# EAGLE design Battery levelling (EAGLE 9.6.1)
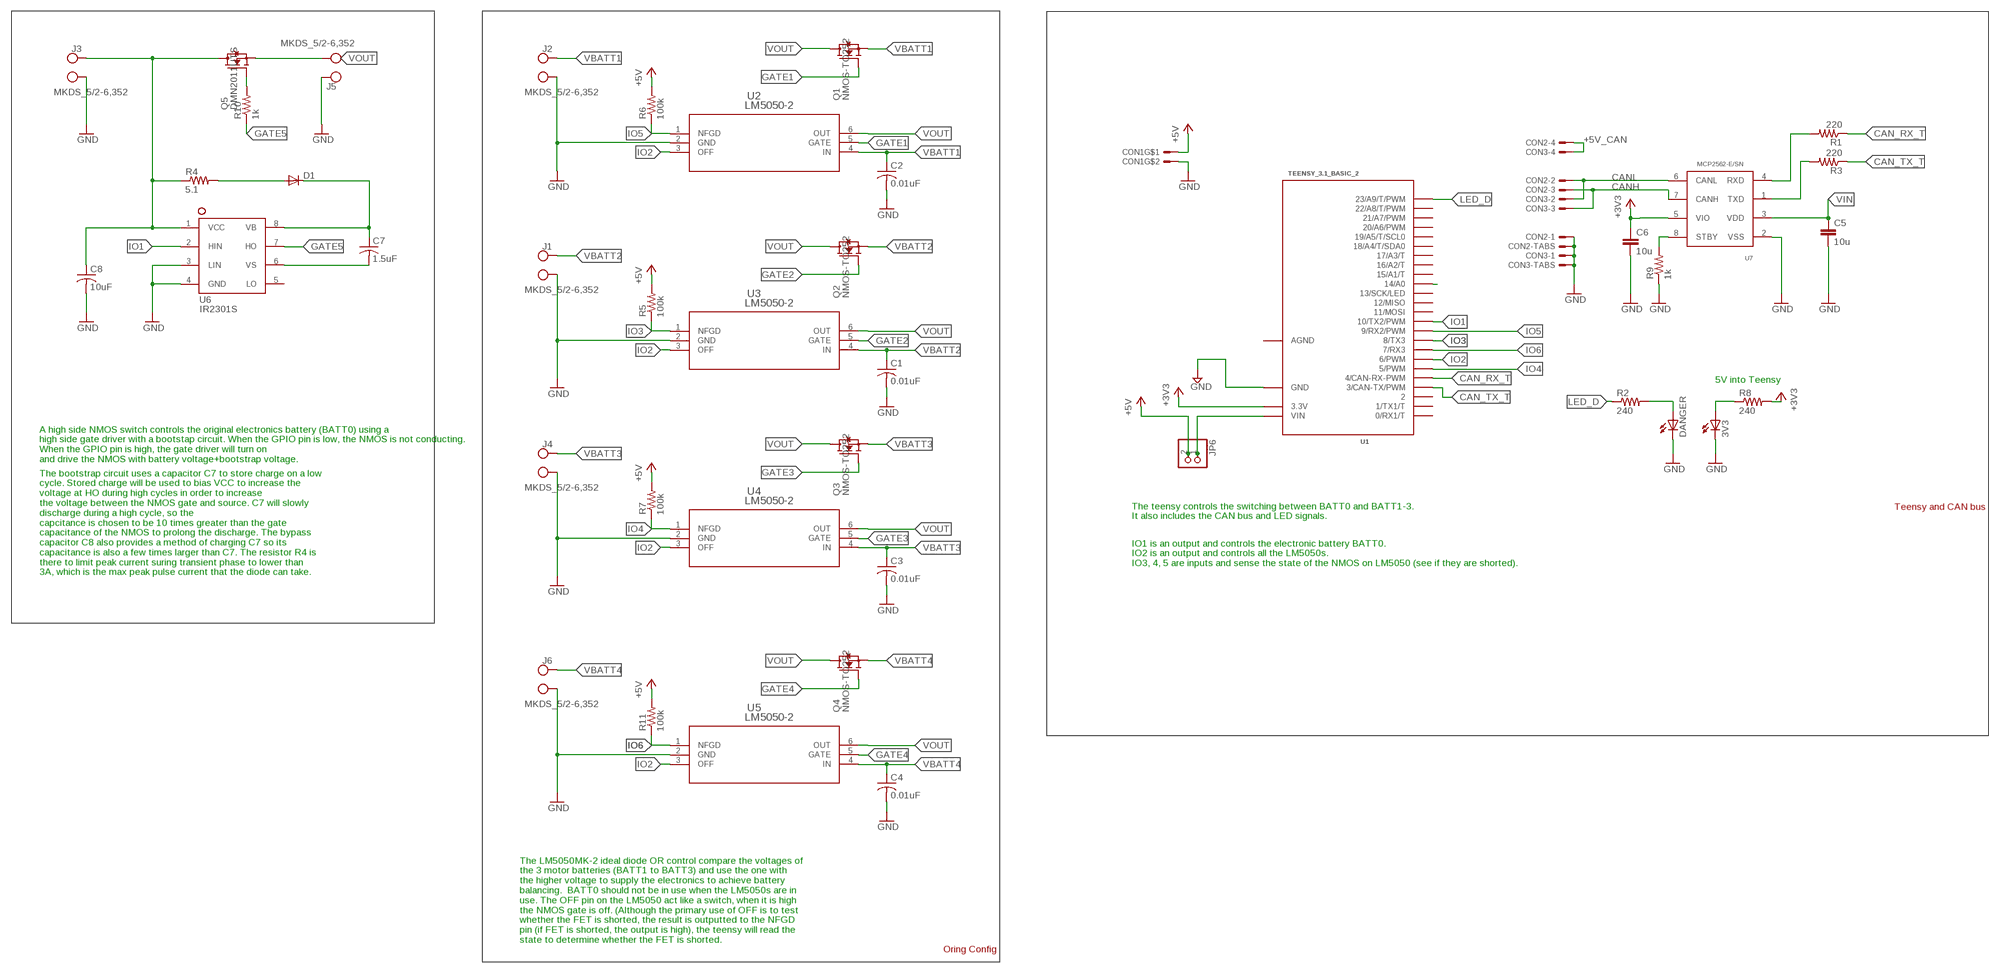
[diagram p0: schematic, sheet 1]

## Parts
3V3  LEDSMT1206  [1206]
C1  0.01uF  C-USC0805  [C0805]
C2  0.01uF  C-USC0805  [C0805]
C3  0.01uF  C-USC0805  [C0805]
C4  0.01uF  C-USC0805  [C0805]
C5  10u  C-EUC0805  [C0805]
C6  10u  C-EUC0805  [C0805]
C7  1.5uF  C-USC0805  [C0805]
C8  10uF  C-USC1206  [C1206]
CON1  MOLEX_5566-2  [5566-2]
CON2  SM04B-GHS-TB  [SM04B-GHS-TB]
CON3  SM04B-GHS-TB  [SM04B-GHS-TB]
D1  DIODE-DO-214AC  [DO-214AC]
DANGER  LEDSMT1206  [1206]
J1  MKDS_5/2-6,352  [MKDS_5/2-6,35]
J2  MKDS_5/2-6,352  [MKDS_5/2-6,35]
J3  MKDS_5/2-6,352  [MKDS_5/2-6,35]
J4  MKDS_5/2-6,352  [MKDS_5/2-6,35]
J5  MKDS_5/2-6,352  [MKDS_5/2-6,35]
J6  MKDS_5/2-6,352  [MKDS_5/2-6,35]
JP6  PINHD-1X2  [1X02]
Q1  NMOS-TO252  [TO252]
Q2  NMOS-TO252  [TO252]
Q3  NMOS-TO252  [TO252]
Q4  NMOS-TO252  [TO252]
Q5  DMN2011UTS  [SOP65P640X120-8N]
R1  220  R-US_R0805  [R0805]
R2  240  R-US_R1206  [R1206]
R3  220  R-US_R0805  [R0805]
R4  5.1  R-US_R1206  [R1206]
R5  100k  R-US_R1206  [R1206]
R6  100k  R-US_R1206  [R1206]
R7  100k  R-US_R1206  [R1206]
R8  240  R-US_R1206  [R1206]
R9  1k  R-US_R0805  [R0805]
R10  1k  R-US_R0805  [R0805]
R11  100k  R-US_R1206  [R1206]
U1  TEENSY_3.1_BASIC_2  [TEENSY_3.1_BASIC_2]
U2  LM5050-2  [MK06A]
U3  LM5050-2  [MK06A]
U4  LM5050-2  [MK06A]
U5  LM5050-2  [MK06A]
U6  IR2301S  [SOIC8]
U7  MCP2562-E/SN  [SOIC8]

## Nets
+3V3: C6.1 R8.2 U1.3.3V U7.5(VIO)
+5V: CON1.1 R5.2 R6.2 R7.2 R11.2
+5V1: JP6.2
+5V_CAN: CON2.P$4 CON3.P$4
CAN_RX1: R1.2 U7.4(RXD)
CAN_RX_T: R1.1 U1.4(4/CAN-RX-PWM)
CAN_TX2: R3.2 U7.1(TXD)
CAN_TX_T: R3.1 U1.3(3/CAN-TX/PWM)
CANH: CON2.P$3 CON3.P$3 U7.7(CANH)
CANL: CON2.P$2 CON3.P$2 U7.6(CANL)
GATE1: Q1.1(G) U2.5(GATE)
GATE2: Q2.1(G) U3.5(GATE)
GATE3: Q3.1(G) U4.5(GATE)
GATE4: Q4.1(G) U5.5(GATE)
GATE5: R10.1 U6.7(HO)
GND: 3V3.C C1.2 C2.2 C3.2 C4.2 C5.2 C6.2 C8.2 CON1.2 CON2.P$1 CON2.P$5 CON2.P$6 CON3.P$1 CON3.P$5 CON3.P$6 DANGER.C J1.1(KL) J2.1(KL) J3.1(KL) J4.1(KL) J5.2(KL1) J6.1(KL) R9.1 U1.GND U2.2(GND) U3.2(GND) U4.2(GND) U5.2(GND) U6.3(LIN) U6.4(GND) U7.2(VSS)
IO1: U1.10(10/TX2/PWM) U6.2(HIN)
IO2: U1.6(6/PWM) U2.3(OFF) U3.3(OFF) U4.3(OFF) U5.3(OFF)
IO3: R5.1 U1.8(8/TX3) U3.1(NFGD)
IO4: R7.1 U1.5(5/PWM) U4.1(NFGD)
IO5: R6.1 U1.9(9/RX2/PWM) U2.1(NFGD)
IO6: R11.1 U1.7(7/RX3) U5.1(NFGD)
LEAK_IN: U1.14/A0
LED_D: R2.1 U1.23/A9(23/A9/T/PWM)
N$1: C8.1 J3.2(KL1) Q5.5(D) Q5.6(D) Q5.7(D) Q5.8(D) R4.1 U6.1(VCC)
N$2: DANGER.A R2.2
N$3: D1.A R4.2
N$4: C7.2 U6.6(VS)
N$5: C7.1 D1.C U6.8(VB)
N$7: Q5.4(G) R10.2
N$17: 3V3.A R8.1
STB1: R9.2 U7.8(STBY)
VBATT1: C2.1 J2.2(KL1) Q1.3(S) U2.4(IN)
VBATT2: C1.1 J1.2(KL1) Q2.3(S) U3.4(IN)
VBATT3: C3.1 J4.2(KL1) Q3.3(S) U4.4(IN)
VBATT4: C4.1 J6.2(KL1) Q4.3(S) U5.4(IN)
VIN: C5.1 U1.VIN U7.3(VDD)
VIN1: JP6.1
VOUT: J5.1(KL) Q1.2(D) Q2.2(D) Q3.2(D) Q4.2(D) Q5.1(S) Q5.2(S) Q5.3(S) U2.6(OUT) U3.6(OUT) U4.6(OUT) U5.6(OUT)
Unconnected: U1.0(0/RX1/T) U1.1(1/TX1/T) U1.2 U1.11(11/MOSI) U1.12(12/MISO) U1.13(13/SCK/LED) U1.15/A1(15/A1/T) U1.16/A2(16/A2/T) U1.17/A3(17/A3/T) U1.18/A4(18/A4/T/SDA0) U1.19/A5(19/A5/T/SCL0) U1.20/A6(20/A6/PWM) U1.21/A7(21/A7/PWM) U1.22/A8(22/A8/T/PWM) U6.5(LO)

## Notes on the sheet
- 5V into Teensy
- A high side NMOS switch controls the original electronics battery (BATT0) using a
  high side gate driver with a bootstap circuit. When the GPIO pin is low, the NMOS is not conducting. 
  When the GPIO pin is high, the gate driver will turn on
  and drive the NMOS with battery voltage+bootstrap voltage.
- Teensy and CAN bus
- The teensy controls the switching between BATT0 and BATT1-3.
  It also includes the CAN bus and LED signals.
- IO1 is an output and controls the electronic battery BATT0.
  IO2 is an output and controls all the LM5050s.
  IO3, 4, 5 are inputs and sense the state of the NMOS on LM5050 (see if they are shorted).
- The bootstrap circuit uses a capacitor C7 to store charge on a low 
  cycle. Stored charge will be used to bias VCC to increase the
  voltage at HO during high cycles in order to increase 
  the voltage between the NMOS gate and source. C7 will slowly 
  discharge during a high cycle, so the
  capcitance is chosen to be 10 times greater than the gate
  capacitance of the NMOS to prolong the discharge. The bypass
  capacitor C8 also provides a method of charging C7 so its
  capacitance is also a few times larger than C7. The resistor R4 is
  there to limit peak current suring transient phase to lower than
  3A, which is the max peak pulse current that the diode can take.
- The LM5050MK-2 ideal diode OR control compare the voltages of
  the 3 motor batteries (BATT1 to BATT3) and use the one with
  the higher voltage to supply the electronics to achieve battery
  balancing.  BATT0 should not be in use when the LM5050s are in
  use. The OFF pin on the LM5050 act like a switch, when it is high
  the NMOS gate is off. (Although the primary use of OFF is to test
  whether the FET is shorted, the result is outputted to the NFGD
  pin (if FET is shorted, the output is high), the teensy will read the
  state to determine whether the FET is shorted.
- Oring Config

## Power pins joined to a net without a drawn wire
AGND: U1.AGND

## Library data of the parts
3V3 DANGER = adafruit:LED: LED OSRAM: - CHIPLED LG R971, LG N971, LY N971, LG Q971, LY Q971, LO R971, LY R971 LH N974, LH R974 LS Q976, LO Q976, LY Q976 LO Q996 - Hyper CHIPLED LW Q18S LB Q993, LB Q99A, LB R99A - SideLED LS A670, LO A670, LY A670, LG A670, LP A670 LB A673, LV A673, LT A673, LW A673 LH A674 LY A675 LS A676, LA A676, LO A676, LY A676, LW A676 LS A679, LY A679, LG A679 - Hyper Micro SIDELED® LS Y876, LA Y876, LO Y876, LY Y876 LT Y87S - SmartLED LW L88C, LW L88S LB L89C, LB L89S, LG L890 LS L89K, LO L89K, LY L89K LS L896, LA L896, LO L896, LY L896 - TOPLED LS T670, LO T670, LY T670, LG T670, LP T670 LSG T670, LSP T670, LSY T670, LOP T670, LYG T670 LG T671, LOG T671, LSG T671 LB T673, LV T673, LT T673, LW T673 LH T674 LS T676, LA T676, LO T676, LY T676, LB T676, LH T676, LSB T676, LW T676 LB T67C, LV T67C, LT T67C, LS T67K, LO T67K, LY T67K, LW E67C LS E67B, LA E67B, LO E67B, LY E67B, LB E67C, LV E67C, LT E67C LW T67C LS T679, LY T679, LG T679 LS T770, LO T770, LY T770, LG T770, LP T770 LB T773, LV T773, LT T773, LW T773 LH T774 LS E675, LA E675, LY E675, LS T675 LS T776, LA T776, LO T776, LY T776, LB T776 LHGB T686 LT T68C, LB T68C - Hyper Mini TOPLED® LB M676 - Mini TOPLED Santana® LG M470 LS M47K, LO M47K, LY M47K Source: http://www.osram.convergy.de/
C1-C4 C7 C8 = adafruit:C-US: CAPACITOR, American symbol
C5 C6 = rcl:C-EU: CAPACITOR, European symbol
CON1 = ARVP:MOLEX_5566-2
CON2 CON3 = ARVP:SM04B-GHS-TB
D1 = diode:DIODE-: DIODE
J1-J6 = Moira:MKDS_5/2-6,35: CONN TERM BLOCK 2POS 6.35MM PCB, 2 Position Wire to Board Terminal Block Horizontal with Board 0.250" (6.35mm) Through Hole, Phoenix Contact (1714955), Digikey:277-1269-ND, MKDS 5/2-6,35 package adpated from Eagle library package MKDS 5/3-6,35
JP6 = pinhead:PINHD-1X2: PIN HEADER
Q1-Q4 = AlbertaSat:NMOS-TO252
Q5 = Lydia:DMN2011UTS: MOSFET N-CH 20V 21A 8-TSSOP 20V 21A (Tc) 1.3W (Ta)
R1 R3 R9 R10 = rcl:R-US_: RESISTOR, American symbol
R2 R8 = resistor:R-US_: RESISTOR, American symbol
R4-R7 R11 = adafruit:R-US_: RESISTOR, American symbol
U1 = Teensy_3_Series_Board_v1.0:TEENSY_3.1_BASIC_2: Footprint for Teensy 3.1 board using all pin connections on the outer perimeter
U2-U5 = AlbertaSat:LM5050-2
U6 = Lydia:IR2301S
U7 = Lydia:MCP2562-E/SN

## Board
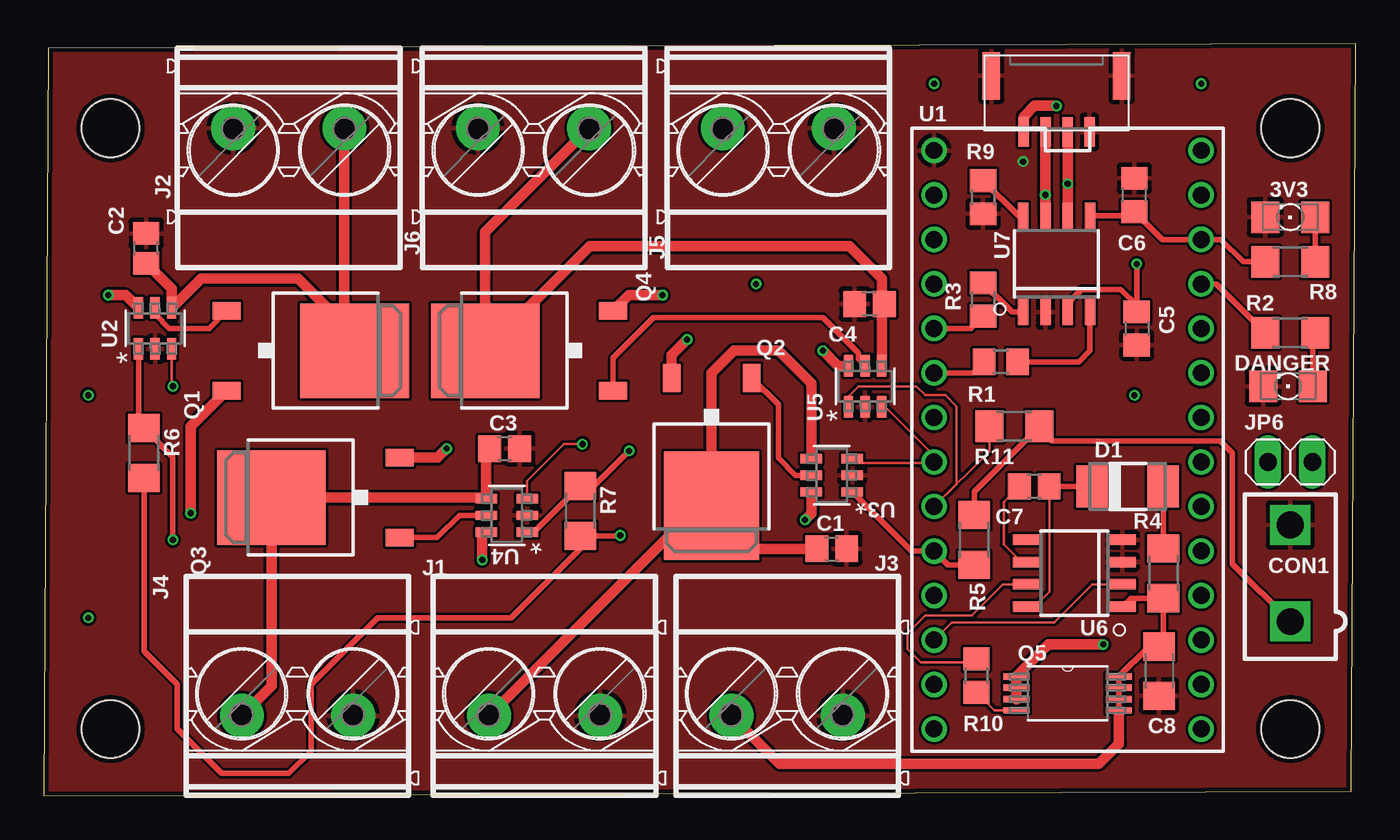
[diagram p1: board, top side]
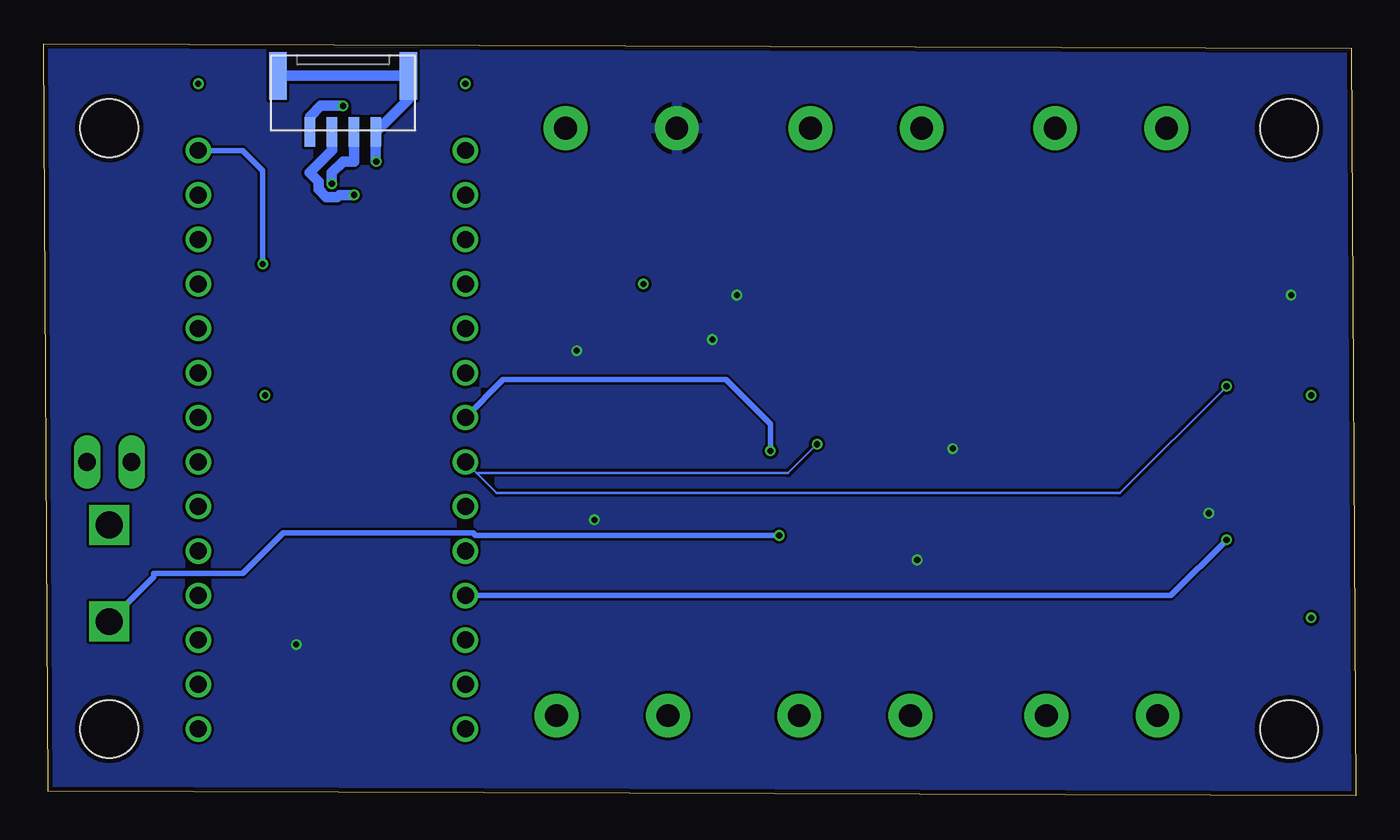
[diagram p2: board, bottom side, seen from below]

Size 74.85 x 42.92 mm. Coordinates in mm from the lower left corner, seen from the top.
Outline: 0,0 74.6,0.25 74.85,42.92 0.25,42.66 0,0
Copper layers (1*16): Top 0.035mm / dielectric 1.5mm / Bottom 0.035mm
Design rules "OSHPark2Layer": minimum track width 6mil, minimum drill 10mil, track to track 6mil, track to pad 6mil, pad to pad 6mil, via to via 6mil, smd to smd 0mil, copper to edge 10mil, drill to drill 10mil, minimum pad ring 5mil, minimum via ring 5mil, stop-mask expansion 2mil, vias tented up to drill 100mil, thermal gap 10mil

### Footprints (pad centres in the part's own frame; a part is rotated, then mirrored left to right if it is on the bottom)
1206 = smd 1.6 x 1.803: A -1.422,0; C 1.422,0
C0805 = smd 1.3 x 1.5: 1 -0.85,0; 2 0.85,0
C0805' = smd 1.3 x 1.5: 1 -0.95,0; 2 0.95,0
C1206 = smd 1.6 x 1.8: 1 -1.4,0; 2 1.4,0
5566-2 = drill 1.524 square: 1 0,-2.756; 2 0,2.756
SM04B-GHS-TB = smd 0.6 x 1.7: P$1 -1.875,0.85; P$2 -0.625,0.85; P$3 0.625,0.85; P$4 1.875,0.85 | smd 1 x 2.7: P$5 -3.725,-2.35; P$6 3.725,-2.35
DO-214AC = smd 1.8 x 2.4: A 2.025,0; C -2.025,0
MKDS_5/2-6,35 = drill 1.3 pad 2.5: 1 -3.175,0; 2 3.175,0
1X02 = drill 1.016 long: 1 -1.27,0; 2 1.27,0
TO252 = smd 1 x 1.6: 1 -2.28,-4.8; 2 2.28,-4.8 | smd 5.4 x 6.2: 3 0,2.5
SOP65P640X120-8N = smd 1.473 x 0.356: 1 -2.921,0.965; 2 -2.921,0.33; 3 -2.921,-0.33; 4 -2.921,-0.965; 5 2.921,-0.965; 6 2.921,-0.33; 7 2.921,0.33; 8 2.921,0.965
R0805 = smd 1.3 x 1.5: 1 -0.95,0; 2 0.95,0
R1206 = smd 1.6 x 1.803: 1 -1.422,0; 2 1.422,0
TEENSY_3.1_BASIC_2 = drill 0.965: 0 -7.62,13.97; 1 -7.62,11.43; 2 -7.62,8.89; 3 -7.62,6.35; 3.3V 7.62,11.43; 4 -7.62,3.81; 5 -7.62,1.27; 6 -7.62,-1.27; 7 -7.62,-3.81; 8 -7.62,-6.35; 9 -7.62,-8.89; 10 -7.62,-11.43; 11 -7.62,-13.97; 12 -7.62,-16.51; 13 7.62,-16.51; 14/A0 7.62,-13.97; 15/A1 7.62,-11.43; 16/A2 7.62,-8.89; 17/A3 7.62,-6.35; 18/A4 7.62,-3.81; 19/A5 7.62,-1.27; 20/A6 7.62,1.27; 21/A7 7.62,3.81; 22/A8 7.62,6.35; 23/A9 7.62,8.89; AGND 7.62,13.97; GND -7.62,16.51; VIN 7.62,16.51
MK06A = smd 1.219 x 0.533: 1 -1.168,0.95; 2 -1.168,0; 3 -1.168,-0.95; 4 1.168,-0.95; 5 1.168,0; 6 1.168,0.95
SOIC8 = smd 0.6 x 1.5: 1 -1.905,-2.75; 2 -0.635,-2.75; 3 0.635,-2.75; 4 1.905,-2.75; 5 1.905,2.75; 6 0.635,2.75; 7 -0.635,2.75; 8 -1.905,2.75
STAND-OFF = hole 3.302: 0,0

### Placement (x,y rotation side)
3V3  71.12,33.02 180 top
C1  44.96,14.1 0 top
C2  5.84,31.24 90 top
C3  26.29,19.81 0 top
C4  47.12,28.07 180 top
C5  10u  [C0805']  62.36,26.67 270 top
C6  10u  [C0805']  62.23,34.29 90 top
C7  56.52,17.65 180 top
C8  63.63,7.11 270 top
CON1  71.12,12.7 0 top
CON2  57.78,38.73 180 top
CON3  57.78,38.73 180 bottom
D1  61.85,17.65 0 top
DANGER  70.99,23.37 180 top
J1  28.57,4.57 180 top
J2  13.97,38.1 0 top
J3  42.42,4.57 180 top
J4  14.48,4.57 180 top
J5  41.91,38.1 0 top
J6  27.94,38.1 0 top
JP6  71.12,19.05 0 top
Q1  15.24,25.4 270 top
Q2  38.1,19.05 180 top
Q3  15.49,17.02 90 top
Q4  27.69,25.4 90 top
Q5  58.42,5.84 0 top
R1  54.61,24.77 0 top
R2  71.12,26.42 0 top
R3  53.59,28.32 90 top
R4  63.88,12.7 90 top
R5  53.09,14.61 90 top
R6  5.71,19.56 270 top
R7  30.61,16.26 270 top
R8  71.12,30.48 180 top
R9  53.59,34.16 90 top
R10  53.21,6.86 270 top
R11  55.37,21.08 0 top
U1  58.42,20.32 0 top
U2  6.35,26.67 90 top
U3  44.96,18.29 180 top
U4  26.42,16 180 top
U5  46.86,23.37 90 top
U6  58.8,12.7 90 top
U7  57.78,30.35 0 top
U$1  [STAND-OFF]  71.12,3.81 90 top
U$2  [STAND-OFF]  71.12,38.1 90 top
U$3  [STAND-OFF]  3.81,38.1 90 top
U$4  [STAND-OFF]  3.81,3.81 90 top

### Tracks (layer width: path | path; a pad name or v marks a point on that pad's centre or on a via)
+3V3
  Top 0.305: C6.1 62.39,33.18 | 62.39,33.18 63.82,31.75 U1.3.3V 67.16,31.75 68.43,30.48 R8.2 | U7.5 62.31,33.1 62.39,33.18
+5V  (via drill 0.35)
  Top 0.305: CON1.1 67.82,13.25 67.82,19.56 67.13,20.24 57.51,20.24 56.79,20.95 R11.2 53.09,17.37 R5.2 | v32.89,14.86 32.87,14.83 R7.2 30.61,14.1 26.67,10.16 19.05,10.16 15.24,6.35 15.24,2.54 13.97,1.27 10.16,1.27 7.62,3.81 7.62,6.35 5.71,8.26 R6.2
  Bottom 0.305: v32.89,14.86 50.22,14.86 50.37,15.01 61.19,15.01 63.5,12.7 68.58,12.7 68.58,12.48 CON1.1
+5V_CAN  (via drill 0.35)
  Top 0.61: v57.78,39.37 56.52,39.37 55.91,38.77 CON2.P$4
  Bottom 0.61: CON3.P$4 59.66,38.77 59.05,39.37 v57.78,39.37
CAN_RX1
  Top 0.305: R1.2 59.05,24.77 59.69,25.4 U7.4
CAN_RX_T
  Top 0.305: R1.1 53.02,24.13 U1.4
CAN_TX2
  Top 0.305: R3.2 55.26,27.6 U7.1
CAN_TX_T
  Top 0.305: R3.1 52.89,26.67 U1.3
CANH  (via drill 0.35)
  Top 0.61: 57.17,33.12 U7.7 v57.15,34.29 CON2.P$3
  Bottom 0.61: v57.15,34.29 57.98,34.29 58.1,34.16 58.74,34.16 59.18,34.61 59.18,35.05 59.69,35.56 58.41,36.84 CON3.P$3
CANL  (via drill 0.35)
  Top 0.61: U7.6 v58.42,34.92 CON2.P$2
  Bottom 0.61: v58.42,34.92 58.42,35.56 57.78,36.2 57.15,36.2 CON3.P$2
GATE1
  Top 0.305: U2.5 6.35,27.48 7.16,26.67 7.18,26.67 7.18,26.66 9.42,26.66 Q1.1
GATE2
  Top 0.305: Q2.1 41.91,22.32 41.91,19.28 42.9,18.29 U3.5
GATE3
  Top 0.305: Q3.1 22.45,14.73 23.72,16 U4.5
GATE4
  Top 0.305: U5.5 46.48,24.91 46.48,25.27 44.45,27.3 34.8,27.3 32.49,24.99 Q4.1
GATE5
  Top 0.152: R10.1 53.02,7.62 50.04,7.62 49.28,8.38 49.28,9.27 50.29,10.29 52.96,10.29 54.74,12.06 U6.7
GND  (via drill 0.35)
  Bottom 0.61: CON3.P$6 CON3.P$5 54.06,39.73 CON3.P$1 55.91,36.23 v55.88,36.2
  pour Top: 0,0 74.93,0 74.93,43.18 0,43.18
IO1
  Top 0.152: U6.2 59.82,12.06 57.66,9.91 51.82,9.91 U1.10
IO2  (via drill 0.35)
  Top 0.152: U3.3 46.38,18.98 50.73,18.98 U1.6 50.8,19.43 48.03,22.2 U5.3 | U2.3 7.3,23.43 v7.37,23.37 | v30.73,20.07 29.68,20.07 27.58,17.97 U4.3
  Bottom 0.152: v7.37,23.37 13.46,17.27 49.02,17.27 U1.6 50.16,18.41 32.38,18.41 v30.73,20.07
IO3
  Top 0.305: U3.1 49.49,13.97 U1.8 51.59,13.18 R5.1
IO4  (via drill 0.35)
  Top 0.305: v33.4,19.68 31.39,17.68 R7.1 27.98,15.05 U4.1
  Bottom 0.305: U1.5 48.64,23.75 35.94,23.75 33.4,21.21 v33.4,19.68
IO5  (via drill 0.35)
  Top 0.305: U2.1 5.4,21.3 R6.1 7.37,19.33 v7.37,14.61
  Bottom 0.305: v7.37,14.61 10.54,11.43 U1.9
IO6
  Top 0.152: U5.1 45.91,22.8 46.48,23.37 49.78,23.37 50.29,22.86 51.44,22.86 52.07,22.23 52.07,17.78 U1.7 53.95,19.66 R11.1
LED_D
  Top 0.305: R2.1 66.9,29.21 U1.23/A9
N$1
  Top 0.305: Q5.5 Q5.6 Q5.7 Q5.8 63.05,8.51 C8.1 63.88,8.77 R4.1 62.03,11.28 U6.1
  Top 0.61: J3.2 41.99,1.83 60.2,1.83 61.34,2.97 Q5.5
N$2
  Top 0.305: DANGER.A 72.42,26.29 R2.2
N$3
  Top 0.305: D1.A R4.2
N$4
  Top 0.152: C7.2 54.78,16.76 54.78,14.35 55.79,13.34 U6.6
N$5
  Top 0.152: U6.8 56.52,10.79 57.37,11.64 C7.1
  Top 0.305: D1.C C7.1
N$6  (via drill 0.35)
  other vias: 2.54,10.16
N$7
  Top 0.152: Q5.4 54.24,4.88 R10.2
N$8  (via drill 0.35)
  other vias: 2.54,22.86
N$9  (via drill 0.35)
  other vias: 50.8,40.64
N$10  (via drill 0.35)
  other vias: 66.04,40.64
N$11  (via drill 0.35)
  other vias: 62.23,22.86
N$12  (via drill 0.35)
  other vias: 40.64,29.21
N$17
  Top 0.305: R8.1 3V3.A
STB1
  Top 0.305: R9.2 55.6,33.1 U7.8
VBATT1
  Top 0.61: C2.1 7.3,28.93 U2.4 8.97,29.51 14.52,29.51 17.74,26.29 Q1.3 17.14,26 J2.2
VBATT2
  Top 0.61: J1.2 37.38,16.55 Q2.3 | U3.4 43.79,23.52 41.91,25.4 39.37,25.4 38.1,24.13 Q2.3 | Q2.3 40.55,14.1 C1.1
VBATT3
  Top 0.61: C3.1 25.25,19.62 U4.4 25.18,17.02 Q3.3 12.99,6.26 J4.2
VBATT4
  Top 0.61: J6.2 25.19,32.17 Q4.3 31.16,31.37 45.97,31.37 47.81,29.53 47.81,27.94 | U5.4 47.81,27.94 | C4.1 47.84,27.94 47.81,27.94
VIN  (via drill 0.35)
  Top 0.305: U7.3 58.42,28.11 59.2,28.89 61.47,28.89 62.36,28 C5.1 v62.36,30.35
  Bottom 0.305: v62.36,30.35 62.36,35.69 63.5,36.83 U1.VIN
VOUT  (via drill 0.35)
  Top 0.61: Q5.3 Q5.2 Q5.1 57.33,8.64 v60.45,8.64 | U3.6 43.79,16.1 v43.43,15.75 | Q4.2 33.38,28.57 v35.31,28.57 | U5.6 45.31,24.54 v44.45,25.4 | Q2.2 35.82,25.15 v36.7,26.04 | Q3.2 22.47,19.3 v22.99,19.81 | v25.02,13.46 25.02,14.82 U4.6 | U2.6 4.66,28.57 v3.68,28.57 | Q1.2 8.38,21.06 v8.38,16.13
  pour Bottom: 0,0 74.68,0 74.68,42.67 0,42.67